# Altium schematic sheet 06_Ethernet.SchDoc: Наименование
size 420 x 297 mm; Name: Наименование; ApprovedBy: Сергеева А.А.; CheckedBy: Рогозин А.А.; Author: Кузнецов М.Д.; CompanyName: МГТУ им. Баумана; DocumentNumber: 7; SheetNumber: 6; SheetTotal: 6; PageSetup: Record=PageOptions|CenterHorizontal=True|CenterVertical=True|PrintScale=0.94|XCorrection=1.00|YCorrection=1.00|PrintKind=1|BorderSize=5000000|LeftOffset=0|BottomOffset=0|Orientation=1|PaperLength=1000|PaperWidth=1000|Scale=100|PaperSource=7|PrintQuality=-4|MediaType=1|DitherType=10|PaperKind=A4|PrintScaleMode=1; DecimalNumber: МГТУ.468784.001; HeadOfSector: Нач. сектора; MainDevice: Перв.примен.; Name1: Плата расширения; n_kontr: Н. Контр; t_kontr: Т. Контр; lit_A: О; Name2: для отладочного модуля; DocumentName: Sheet1.SCHDOC
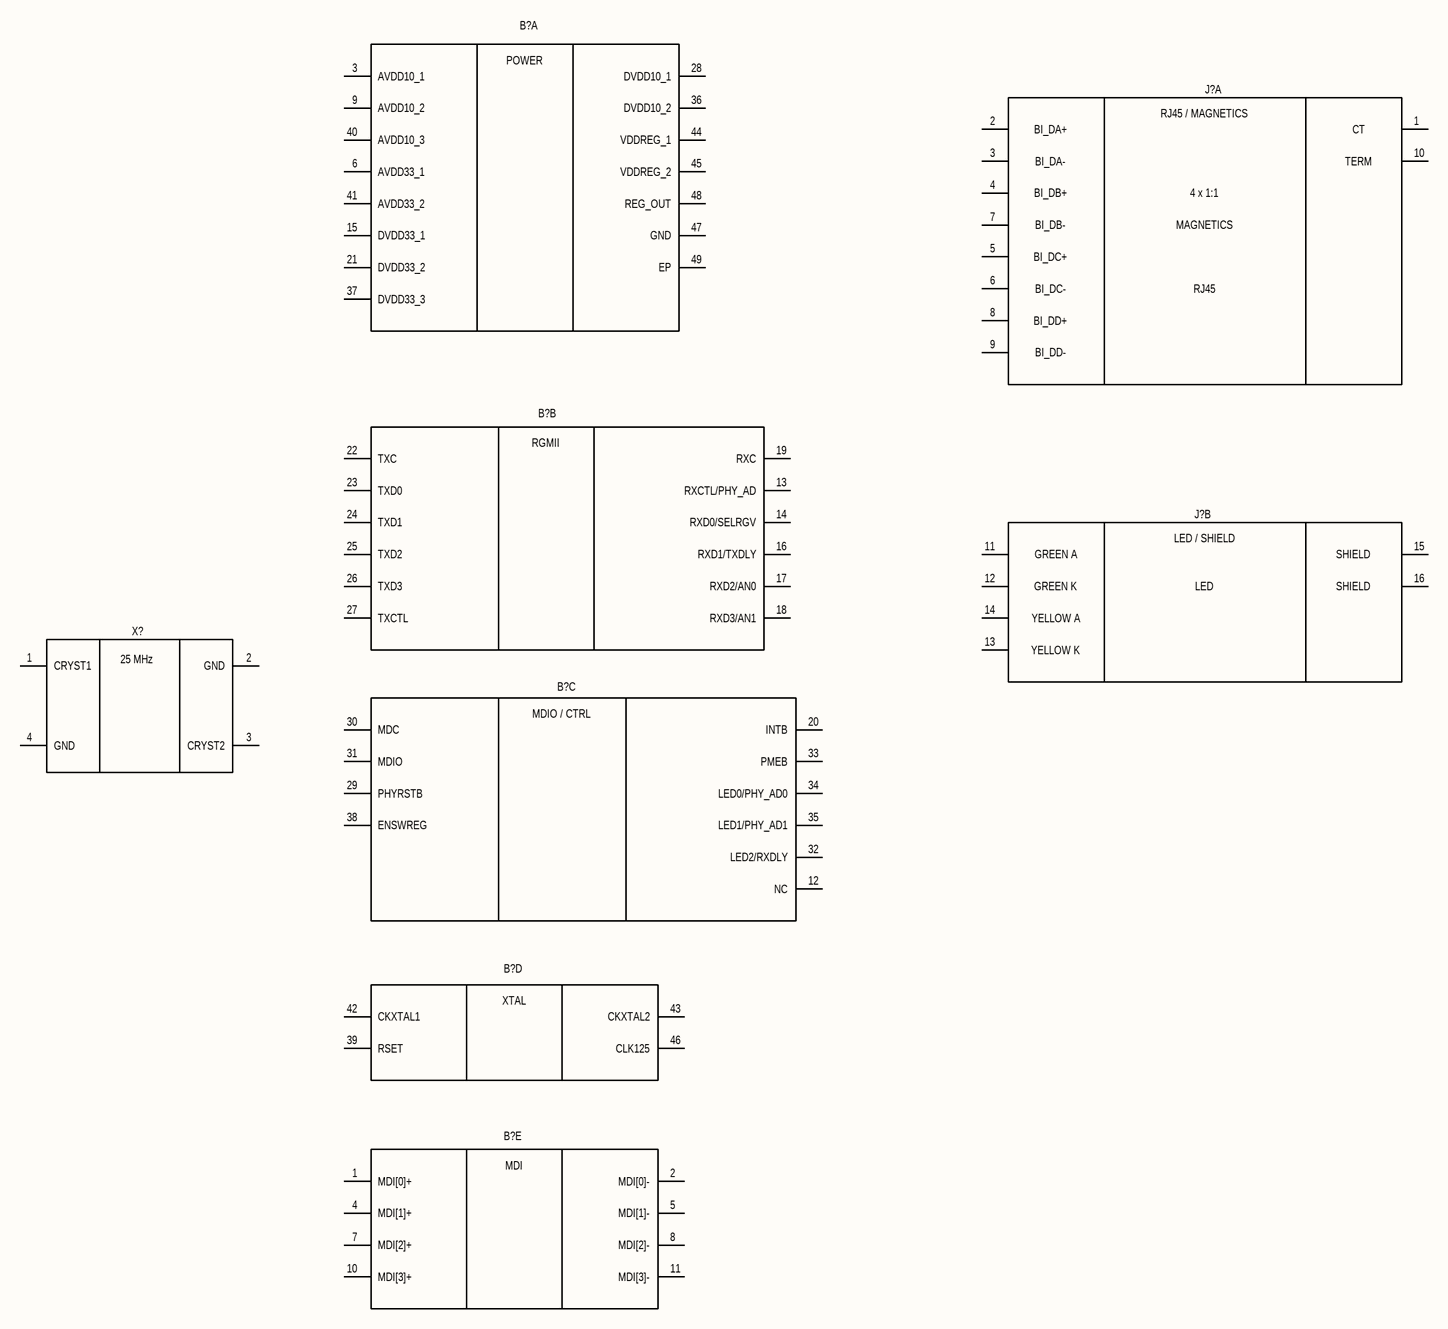
[diagram p0: 06_Ethernet.SchDoc]

## Parts
(Parts that share a designator on the sheet are numbered #1, #2 ... from top to bottom, then left to right.)
B?#1  RTL8211E-VB-CG  [QFN40P600X600X100-49N]  (value not drawn)  (part A of 5)
B?#2  RTL8211E-VB-CG  [QFN40P600X600X100-49N]  (value not drawn)  (part B of 5)
B?#3  RTL8211E-VB-CG  [QFN40P600X600X100-49N]  (value not drawn)  (part C of 5)
B?#4  RTL8211E-VB-CG  [QFN40P600X600X100-49N]  (value not drawn)  (part D of 5)
B?#5  RTL8211E-VB-CG  [QFN40P600X600X100-49N]  (value not drawn)  (part E of 5)
J?#1  HR911130A  [HR911130A]  (value not drawn)  (part A of 2)
J?#2  HR911130A  [HR911130A]  (value not drawn)  (part B of 2)
X?  HKC3225SX-25MHZ-26594-R4V1  [HKC3225SX25MHZ26594R4V1]  (value not drawn)

## Nets

Not connected (* = marked no-connect by the designer): B?#1 3(AVDD10_1) 6(AVDD33_1) 9(AVDD10_2) 15(DVDD33_1) 21(DVDD33_2) 28(DVDD10_1) 36(DVDD10_2) 37(DVDD33_3) 40(AVDD10_3) 41(AVDD33_2) 44(VDDREG_1) 45(VDDREG_2) 47(GND) 48(REG_OUT) 49(EP); B?#2 13(RXCTL/PHY_AD) 14(RXD0/SELRGV) 16(RXD1/TXDLY) 17(RXD2/AN0) 18(RXD3/AN1) 19(RXC) 22(TXC) 23(TXD0) 24(TXD1) 25(TXD2) 26(TXD3) 27(TXCTL); B?#3 12(NC) 20(INTB) 29(PHYRSTB) 30(MDC) 31(MDIO) 32(LED2/RXDLY) 33(PMEB) 34(LED0/PHY_AD0) 35(LED1/PHY_AD1) 38(ENSWREG); B?#4 39(RSET) 42(CKXTAL1) 43(CKXTAL2) 46(CLK125); B?#5 1(MDI[0]+) 2(MDI[0]-) 4(MDI[1]+) 5(MDI[1]-) 7(MDI[2]+) 8(MDI[2]-) 10(MDI[3]+) 11(MDI[3]-); J?#1 1 2 3 4 5 6 7 8 9 10; J?#2 11 12 13 14 15 16; X? 1(CRYST1) 2(GND) 3(CRYST2) 4(GND)

## Notes on the sheet
- Перв.примен.
- Справ.№
- Подп. и дата
- Инв.№ дубл.
- Взам.инв.№
- Подп.и дата
- Разраб.
- Изм.
- Лист
- № докум.
- Подп.
- Дата
- Лит.
- Масштаб
- Масса
- Т.контр.
- Пров.
- СХЕМА   ЭЛЕКТРИЧЕСКАЯ
- ПРИНЦИПИАЛЬНАЯ
- Листов
- Инв.№ подл.
- Утв.
- Н.контр.
- Нач.сект.
- Формат  A3
- (in symbol HKC3225SX-25MHZ-26594-R4V1) 25 MHz
- (in symbol HR911130A, part A) RJ45 / MAGNETICS; BI_DA+; CT; BI_DA-; TERM; BI_DB+; 4 x 1:1; BI_DB-; MAGNETICS; BI_DC+; BI_DC-; RJ45; BI_DD+; BI_DD-
- (in symbol HR911130A, part B) LED / SHIELD; GREEN A; SHIELD; GREEN K; LED; YELLOW A; YELLOW K
- (in symbol RTL8211E-VB-CG, part A) POWER
- (in symbol RTL8211E-VB-CG, part B) RGMII
- (in symbol RTL8211E-VB-CG, part C) MDIO / CTRL
- (in symbol RTL8211E-VB-CG, part D) XTAL
- (in symbol RTL8211E-VB-CG, part E) MDI

## Library data of the parts
B?#1-B?#5 = RTL8211E-VB-CG: h; Manufacturer_Name: Realtek; Geometry.Height: 1mm; Manufacturer_Part_Number: RTL8211E-VB-CG; Mouser Part Number: *; Mouser Price/Stock: *; Arrow Part Number: *; Arrow Price/Stock: *; Datasheet Link: http://download3.dvd-driver.cz/realtek/datasheets/pdf/rtl8211e(g)-vb(vl)-cg_datasheet_1.6.pdf
J?#1 J?#2 = HR911130A: SINGLE PORT RJ45 CONNECTOR WITH INTEGRATED MAGNETICS AND LED; Manufacturer_Name: Hanrun Electronics; Geometry.Height: 13mm; Manufacturer_Part_Number: HR911130A; Mouser Part Number: *; Mouser Price/Stock: *; Arrow Part Number: *; Arrow Price/Stock: *; Datasheet Link: https://datasheet.lcsc.com/szlcsc/Zhongshan-HanRun-Elec-HR911130A_C54408.pdf
X? = HKC3225SX-25MHZ-26594-R4V1: 3225 Ceramic SMD Crystals, 25 MHz; Manufacturer_Name: Hong Kong XвЂ™tals Limited; Geometry.Height: 0.8mm; Manufacturer_Part_Number: HKC3225SX-25MHZ-26594-R4V1; Mouser Part Number: *; Mouser Price/Stock: *; Arrow Part Number: *; Arrow Price/Stock: *; Datasheet Link: https://cms.nacsemi.com/content/AuthDatasheets/HKCrystal/C7.pdf